# Altium schematic sheet motor_drv.SchDoc
size A
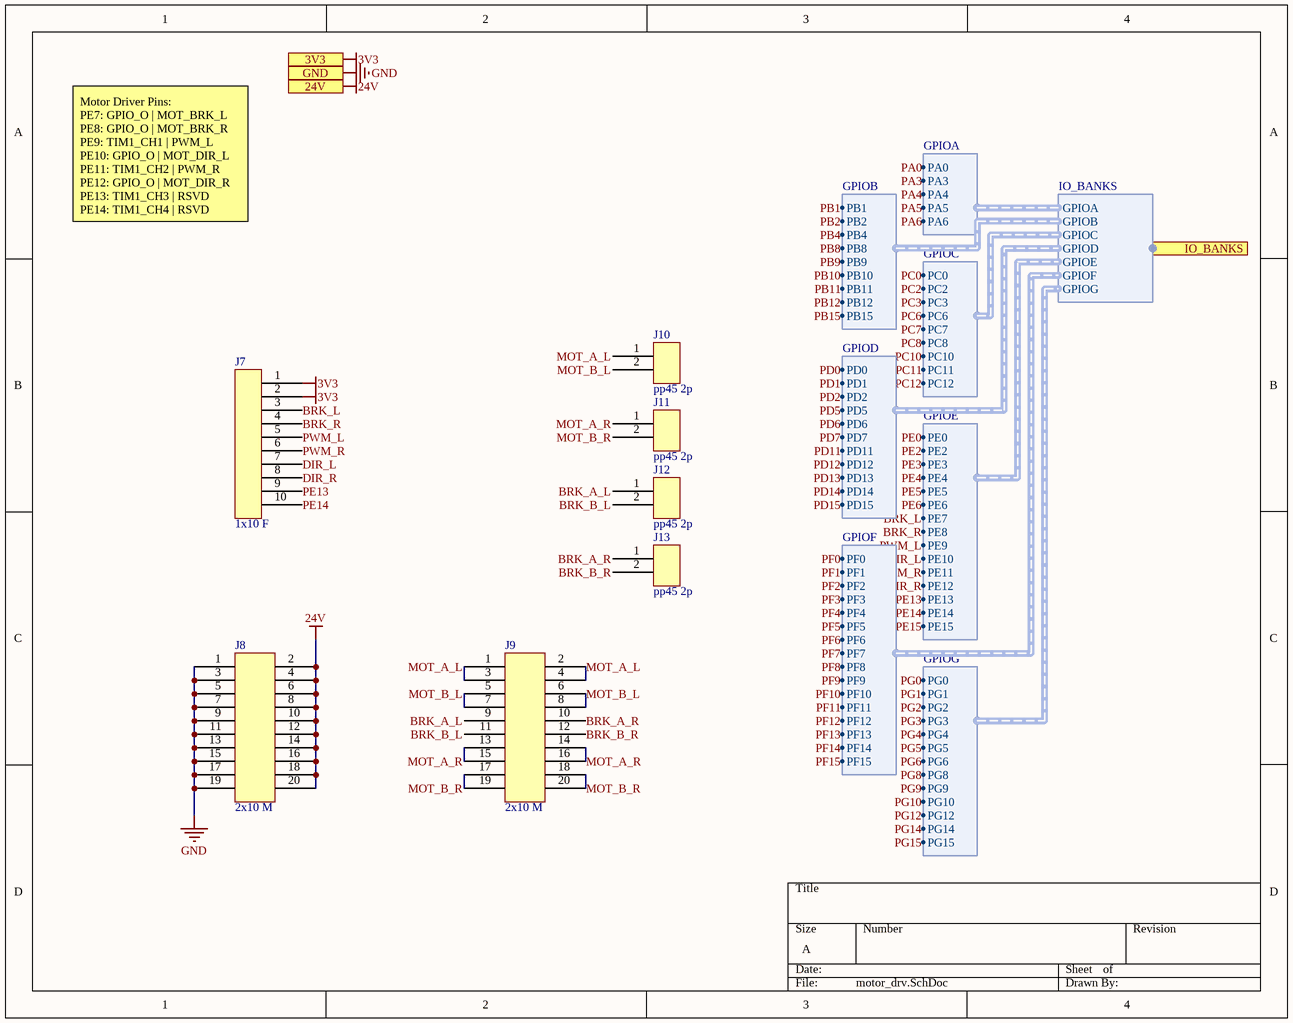
[diagram p0: motor_drv.SchDoc]

## Parts
J7  1x10 F  [CONN HDR 1x10 F]
J8  2x10 M  [CONN HDR 2x10 M TOP]
J9  2x10 M  [CONN HDR 2x10 M TOP]
J10  pp45 2p  [CONN PP45 2P VERT]
J11  pp45 2p  [CONN PP45 2P VERT]
J12  pp45 2p  [CONN PP45 2P VERT]
J13  pp45 2p  [CONN PP45 2P VERT]

## Ports
3V3, 24V, GND, IO_BANKS (harness IO_BANKS)

## Harnesses
IO_BANKS: GPIOA, GPIOB, GPIOC, GPIOD, GPIOE, GPIOF, GPIOG
GPIOA: PA0, PA3, PA4, PA5, PA6
GPIOB: PB1, PB2, PB4, PB8, PB9, PB10, PB11, PB12, PB15
GPIOC: PC0, PC2, PC3, PC6, PC7, PC8, PC10, PC11, PC12
GPIOD: PD0, PD1, PD2, PD5, PD6, PD7, PD11, PD12, PD13, PD14, PD15
GPIOE: PE0, PE2, PE3, PE4, PE5, PE6, PE7, PE8, PE9, PE10, PE11, PE12, PE13, PE14, PE15
GPIOF: PF0, PF1, PF2, PF3, PF4, PF5, PF6, PF7, PF8, PF9, PF10, PF11, PF12, PF13, PF14, PF15
GPIOG: PG0, PG1, PG2, PG3, PG4, PG5, PG6, PG8, PG9, PG10, PG12, PG14, PG15

## Nets
3V3: J7.1 J7.2 ; port 3V3
24V: J8.2 J8.4 J8.6 J8.8 J8.10 J8.12 J8.14 J8.16 J8.18 J8.20 ; port 24V
GND: J8.1 J8.3 J8.5 J8.7 J8.9 J8.11 J8.13 J8.15 J8.17 J8.19 ; port GND
BRK_A_L: J9.9 J12.1
BRK_A_R: J9.10 J13.1
BRK_B_L: J9.11 J12.2
BRK_B_R: J9.12 J13.2
BRK_L: J7.3 ; harness GPIOE.PE7
BRK_R: J7.4 ; harness GPIOE.PE8
DIR_L: J7.7 ; harness GPIOE.PE10
DIR_R: J7.8 ; harness GPIOE.PE12
MOT_A_L: J9.1 J9.2 J9.3 J9.4 J10.1
MOT_A_R: J9.13 J9.14 J9.15 J9.16 J11.1
MOT_B_L: J9.5 J9.6 J9.7 J9.8 J10.2
MOT_B_R: J9.17 J9.18 J9.19 J9.20 J11.2
PA0: harness GPIOA.PA0
PA3: harness GPIOA.PA3
PA4: harness GPIOA.PA4
PA5: harness GPIOA.PA5
PB1: harness GPIOB.PB1
PB2: harness GPIOB.PB2
PB4: harness GPIOB.PB4
PB8: harness GPIOB.PB8
PB9: harness GPIOB.PB9
PB10: harness GPIOB.PB10
PB11: harness GPIOB.PB11
PB12: harness GPIOB.PB12
PB15: harness GPIOB.PB15
PC0: harness GPIOC.PC0
PC2: harness GPIOC.PC2
PC3: harness GPIOC.PC3
PC6: harness GPIOC.PC6
PC7: harness GPIOC.PC7
PC8: harness GPIOC.PC8
PC10: harness GPIOC.PC10
PC11: harness GPIOC.PC11
PC12: harness GPIOC.PC12
PD0: harness GPIOD.PD0
PD1: harness GPIOD.PD1
PD2: harness GPIOD.PD2
PD5: harness GPIOD.PD5
PD6: harness GPIOD.PD6
PD7: harness GPIOD.PD7
PD11: harness GPIOD.PD11
PD12: harness GPIOD.PD12
PD13: harness GPIOD.PD13
PD14: harness GPIOD.PD14
PD15: harness GPIOD.PD15
PE0: harness GPIOE.PE0
PE2: harness GPIOE.PE2
PE3: harness GPIOE.PE3
PE4: harness GPIOE.PE4
PE5: harness GPIOE.PE5
PE6: harness GPIOE.PE6
PE13: J7.9 ; harness GPIOE.PE13
PE14: J7.10 ; harness GPIOE.PE14
PE15: harness GPIOE.PE15
PF0: harness GPIOF.PF0
PF1: harness GPIOF.PF1
PF2: harness GPIOF.PF2
PF3: harness GPIOF.PF3
PF4: harness GPIOF.PF4
PF5: harness GPIOF.PF5
PF6: harness GPIOF.PF6
PF7: harness GPIOF.PF7
PF8: harness GPIOF.PF8
PF9: harness GPIOF.PF9
PF10: harness GPIOF.PF10
PF11: harness GPIOF.PF11
PF12: harness GPIOF.PF12
PF13: harness GPIOF.PF13
PF14: harness GPIOF.PF14
PF15: harness GPIOF.PF15
PG0: harness GPIOG.PG0
PG1: harness GPIOG.PG1
PG2: harness GPIOG.PG2
PG3: harness GPIOG.PG3
PG4: harness GPIOG.PG4
PG5: harness GPIOG.PG5
PG6: harness GPIOG.PG6
PG8: harness GPIOG.PG8
PG9: harness GPIOG.PG9
PG10: harness GPIOG.PG10
PG12: harness GPIOG.PG12
PG14: harness GPIOG.PG14
PG15: harness GPIOG.PG15
PWM_L: J7.5 ; harness GPIOE.PE9
PWM_R: J7.6 ; harness GPIOE.PE11

## Notes on the sheet
- Motor Driver Pins:
  PE7: GPIO_O | MOT_BRK_L
  PE8: GPIO_O | MOT_BRK_R
  PE9: TIM1_CH1 | PWM_L
  PE10: GPIO_O | MOT_DIR_L
  PE11: TIM1_CH2 | PWM_R
  PE12: GPIO_O | MOT_DIR_R
  PE13: TIM1_CH3 | RSVD
  PE14: TIM1_CH4 | RSVD
- Labels drawn without touching a wire or pin: PA6

## Library data of the parts
J7 = CONN header 1x10 F: Supplier 1: Digi-Key; Supplier Part Number 1: S7008-ND
J8 J9 = CONN Header 2x10 M: SBH11-PBPC-D10-ST-BK; Supplier 1: Digi-Key; Supplier Part Number 1: S9172-ND
J10-J13 = CONN pp45 1x2 vert: Heavy Duty Power Connectors PCB45 VERT.MT.SHORT TAIL LP CONT; Manufacturer 1: Anderson Power; Manufacturer Part Number 1: 3-5911P1; Supplier 1: Digi-Key; RoHS: Yes; Category: Connectors; Stock 1: 4595; Pricing 1: 1=0.70000, 10=0.66000, 25=0.59400, 50=0.52800, 100=0.50600, 250=0.46200, 500=0.44000, 1000=0.36300, 2500=0.33000 (USD); ComponentLink1URL: http://www.andersonpower.com/files.php?file=DS-PP1545(2).pdf&src-supplier=Mouser; ComponentLink1Description: http://www.andersonpower.com/files.php?file=DS-PP1545(2).pdf&src-supplier=Mouser; Supplier Part Number 1: 2243-3-5911P1-ND